# EAGLE design main (EAGLE 7.5.0)
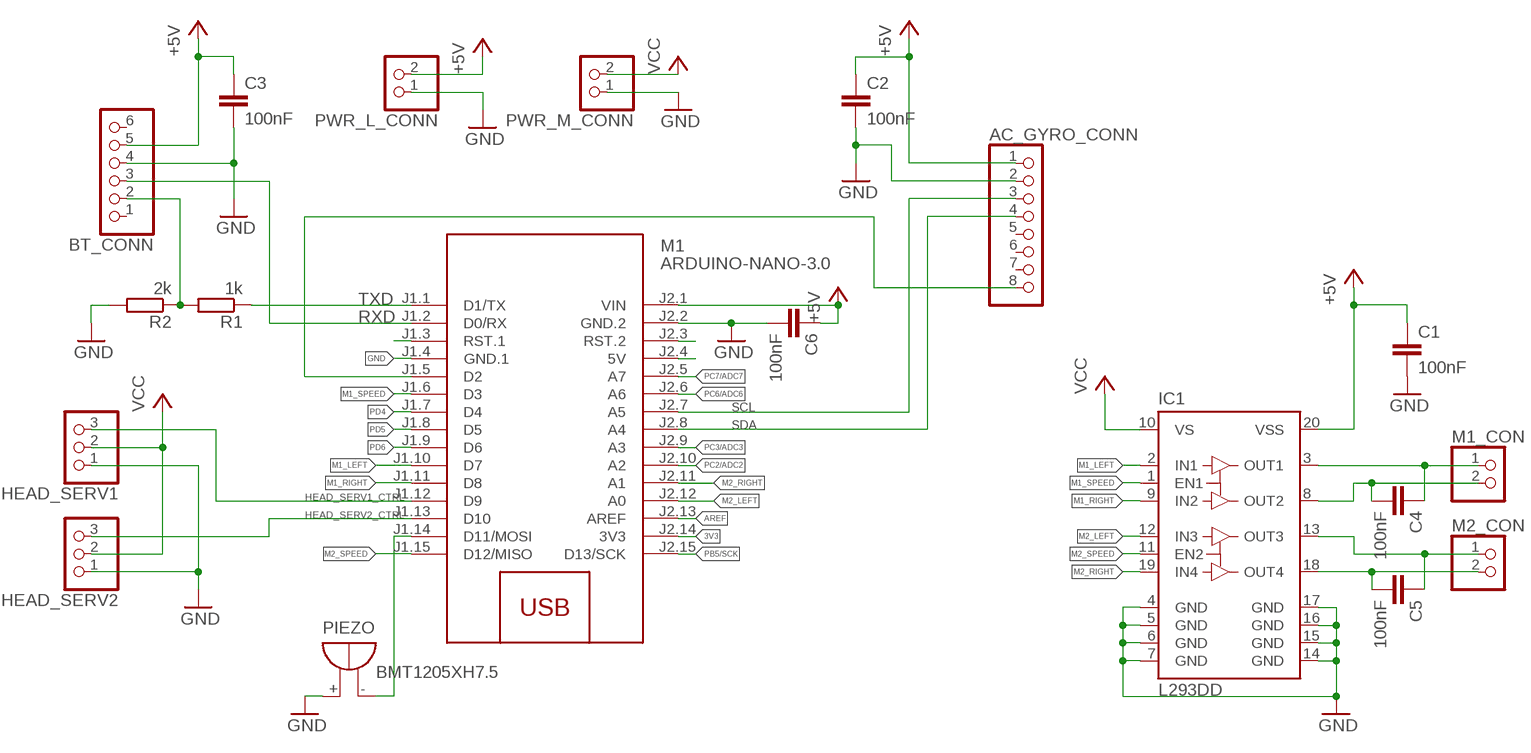
[diagram p0: schematic, sheet 1]

## Parts
AC_GYRO_CONN  PINHD-1X8  [1X08]
BT_CONN  PINHD-1X6  [1X06]
C1  100nF  C-EUC0805  [C0805]
C2  100nF  C-EUC0805  [C0805]
C3  100nF  C-EUC0805  [C0805]
C4  100nF  C-EUC0805  [C0805]
C5  100nF  C-EUC0805  [C0805]
C6  100nF  C-EUC0805  [C0805]
HEAD_SERV1  PINHD-1X3  [1X03]
HEAD_SERV2  PINHD-1X3  [1X03]
IC1  L293DD  [SO20]
M1  ARDUINO-NANO-3.0  [ARDUINO-NANO-3.0]
M1_CON  PINHD-1X2  [1X02]
M2_CON  PINHD-1X2  [1X02]
PIEZO  BMT1205XH7.5  [BMT1205XH7.5]
PWR_L_CONN  PINHD-1X2  [1X02]
PWR_M_CONN  PINHD-1X2  [1X02]
R1  1k  R-EU_0207/10  [0207/10]
R2  2k  R-EU_0207/10  [0207/10]

## Nets
3V3: M1.J2.14(3V3)
+5V: AC_GYRO_CONN.1 BT_CONN.5 C1.1 C2.1 C3.1 C6.1 IC1.20(VSS) M1.J2.1(VIN) PWR_L_CONN.2
AC_GYRO_INT: AC_GYRO_CONN.8 M1.J1.5(D2)
AREF: M1.J2.13(AREF)
GND: AC_GYRO_CONN.2 BT_CONN.4 C1.2 C2.2 C3.2 C6.2 HEAD_SERV1.1 HEAD_SERV2.1 IC1.4(GND) IC1.5(GND) IC1.6(GND) IC1.7(GND) IC1.14(GND) IC1.15(GND) IC1.16(GND) IC1.17(GND) M1.J1.4(GND.1) M1.J2.2(GND.2) PIEZO.+ PWR_L_CONN.1 PWR_M_CONN.1 R2.2
HEAD_SERV1_CTRL: HEAD_SERV1.3 M1.J1.12(D9)
HEAD_SERV2_CTRL: HEAD_SERV2.3 M1.J1.13(D10)
M1_LEFT: IC1.2(IN1) M1.J1.10(D7)
M1_RIGHT: IC1.9(IN2) M1.J1.11(D8)
M1_SPEED: IC1.1(EN1) M1.J1.6(D3)
M2_LEFT: IC1.12(IN3) M1.J2.12(A0)
M2_RIGHT: IC1.19(IN4) M1.J2.11(A1)
M2_SPEED: IC1.11(EN2) M1.J1.15(D12/MISO)
N$1: C4.1 IC1.3(OUT1) M1_CON.1
N$2: C4.2 IC1.8(OUT2) M1_CON.2
N$3: C5.2 IC1.18(OUT4) M2_CON.2
N$4: C5.1 IC1.13(OUT3) M2_CON.1
N$5: BT_CONN.2 R1.2 R2.1
N$6: M1.J1.3(RST.1)
N$11: M1.J2.3(RST.2)
N$13: M1.J2.4(5V)
PB4: M1.J1.14(D11/MOSI) PIEZO.-
PB5/SCK: M1.J2.15(D13/SCK)
PC2/ADC2: M1.J2.10(A2)
PC3/ADC3: M1.J2.9(A3)
PC6/ADC6: M1.J2.6(A6)
PC7/ADC7: M1.J2.5(A7)
PD4: M1.J1.7(D4)
PD5: M1.J1.8(D5)
PD6: M1.J1.9(D6)
RXD: BT_CONN.3 M1.J1.2(D0/RX)
SCL: AC_GYRO_CONN.3 M1.J2.7(A5)
SDA: AC_GYRO_CONN.4 M1.J2.8(A4)
TXD: M1.J1.1(D1/TX) R1.1
VCC: HEAD_SERV1.2 HEAD_SERV2.2 IC1.10(VS) PWR_M_CONN.2
Unconnected: AC_GYRO_CONN.5 AC_GYRO_CONN.6 AC_GYRO_CONN.7 BT_CONN.1 BT_CONN.6

## Library data of the parts
AC_GYRO_CONN = pinhead:PINHD-1X8: PIN HEADER
BT_CONN = pinhead:PINHD-1X6: PIN HEADER
C1-C6 = resistor:C-EU: CAPACITOR, European symbol
HEAD_SERV1 HEAD_SERV2 = pinhead:PINHD-1X3: PIN HEADER
IC1 = st-microelectronics:L293DD: PUSH-PULL FOUR CHANNEL DRIVER WITH DIODES Source: http://www.st.com/stonline/books/pdf/docs/1330.pdf; OC_FARNELL: unknown
M1 = diy-modules:ARDUINO-NANO-3.0: Arduino Nano 3.0
M1_CON M2_CON PWR_L_CONN PWR_M_CONN = pinhead:PINHD-1X2: PIN HEADER
PIEZO = buzzer:BMT1205XH7.5: MAGNETIC TRANSDUCER Source: Http:www.be-star.com; OC_FARNELL: unknown; OC_NEWARK: unknown
R1 R2 = resistor:R-EU_: RESISTOR, European symbol

## Net classes
0 default: clearance 0.205 mm

## Board
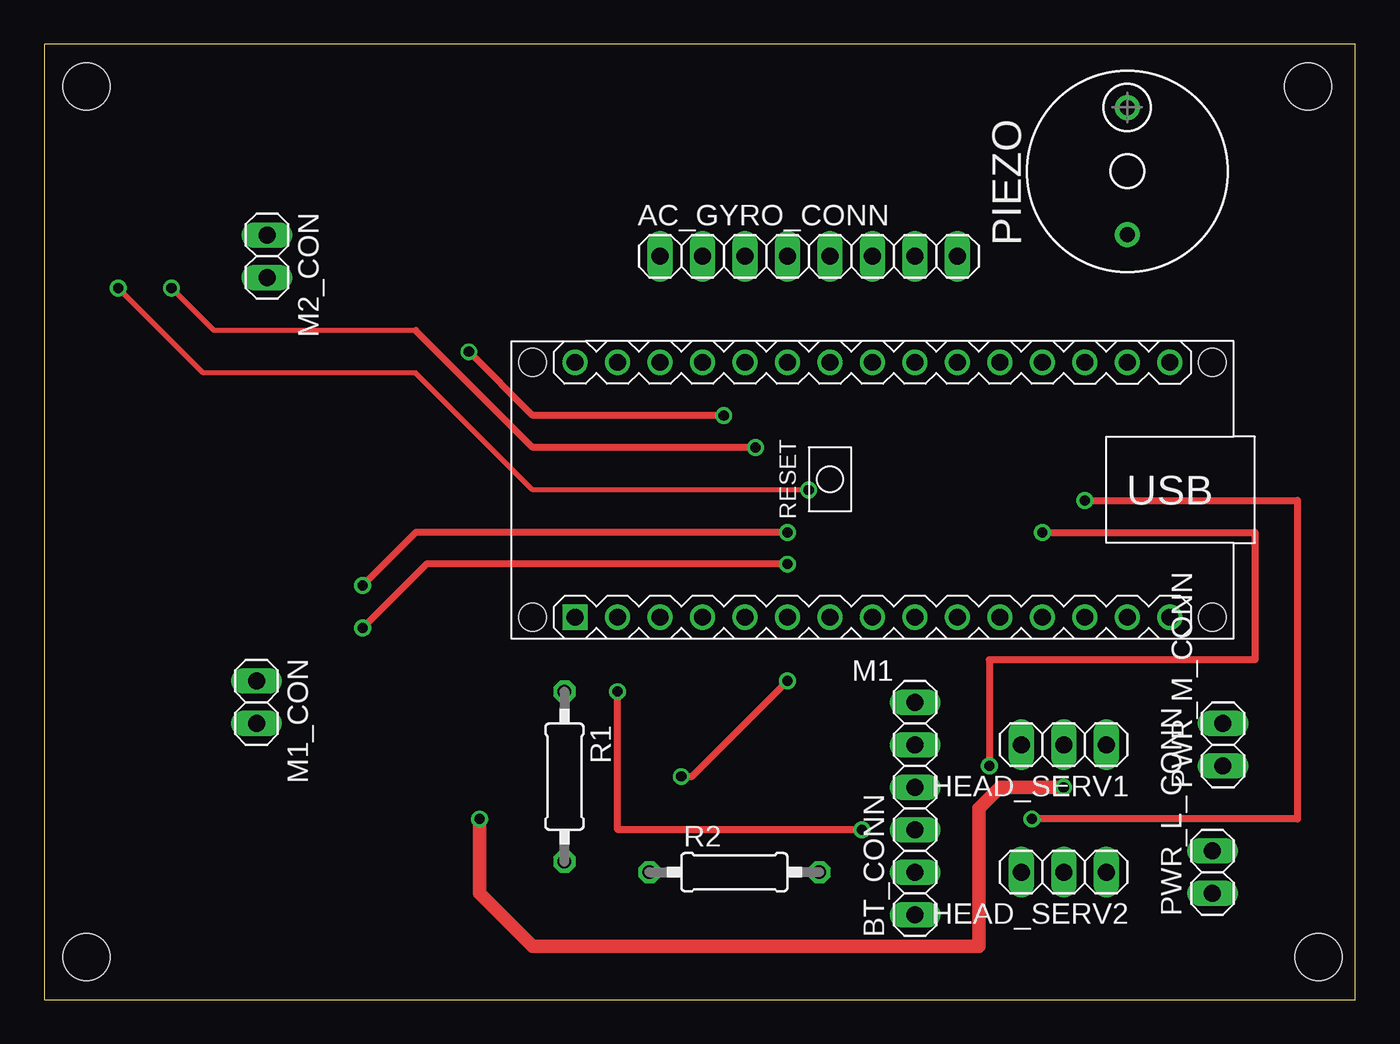
[diagram p1: board, top side]
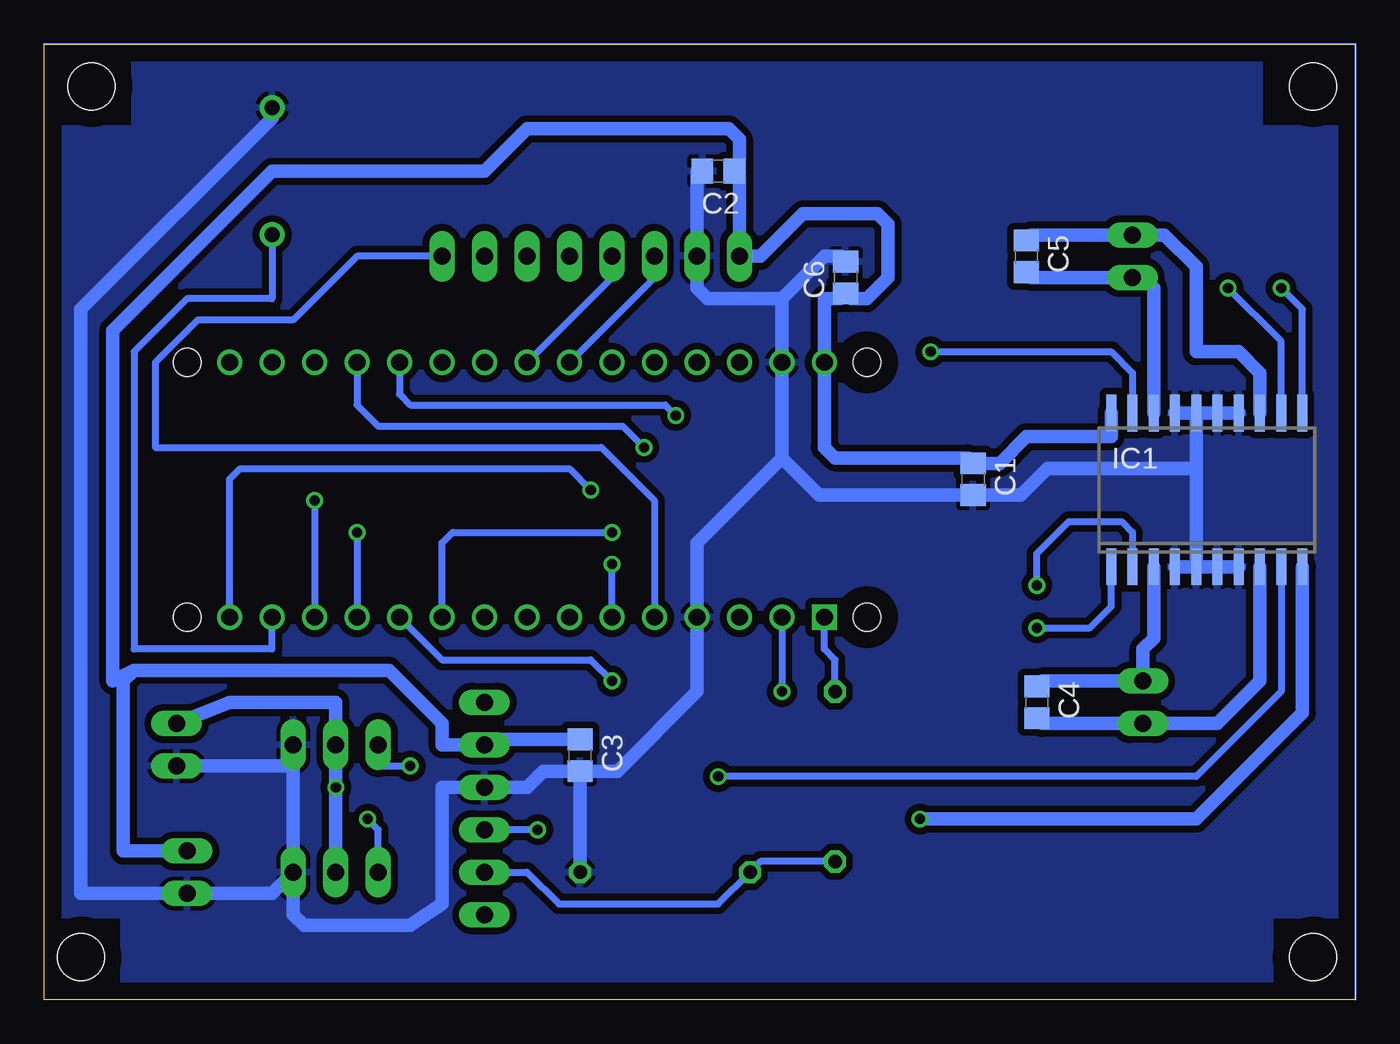
[diagram p2: board, bottom side, seen from below]

Size 78.41 x 57.14 mm. Coordinates in mm from the lower left corner, seen from the top.
Outline: 0,0 78.41,0 78.41,57.14 0,57.14 0,0
Copper layers (1*16): Top 0.035mm / dielectric 1.5mm / Bottom 0.035mm
Design rules "default *": minimum track width 10mil, minimum drill 24mil, track to track 16mil, track to pad 16mil, pad to pad 16mil, via to via 16mil, smd to smd 8mil, copper to edge 40mil, drill to drill 8mil, minimum pad ring 10mil, minimum via ring 8mil, stop-mask expansion 4mil, vias tented up to drill 0mil, thermal gap 10mil
Holes 2.8 mm at 2.54,54.61 75.56,54.61 76.2,2.54 2.54,2.54

### Footprints (pad centres in the part's own frame; a part is rotated, then mirrored left to right if it is on the bottom)
1X08 = drill 1.016 long: 1 -8.89,0; 2 -6.35,0; 3 -3.81,0; 4 -1.27,0; 5 1.27,0; 6 3.81,0; 7 6.35,0; 8 8.89,0
1X06 = drill 1.016 long: 1 -6.35,0; 2 -3.81,0; 3 -1.27,0; 4 1.27,0; 5 3.81,0; 6 6.35,0
C0805 = smd 1.3 x 1.5: 1 -0.95,0; 2 0.95,0
1X03 = drill 1.016 long: 1 -2.54,0; 2 0,0; 3 2.54,0
SO20 = smd 0.6 x 2.2: 1 -5.715,-4.6; 2 -4.445,-4.6; 3 -3.175,-4.6; 4 -1.905,-4.6; 5 -0.635,-4.6; 6 0.635,-4.6; 7 1.905,-4.6; 8 3.175,-4.6; 9 4.445,-4.6; 10 5.715,-4.6; 11 5.715,4.6; 12 4.445,4.6; 13 3.175,4.6; 14 1.905,4.6; 15 0.635,4.6; 16 -0.635,4.6; 17 -1.905,4.6; 18 -3.175,4.6; 19 -4.445,4.6; 20 -5.715,4.6
ARDUINO-NANO-3.0 = drill 1 square: J1.1 17.78,7.62 | drill 1: J1.2 15.24,7.62; J1.3 12.7,7.62; J1.4 10.16,7.62; J1.5 7.62,7.62; J1.6 5.08,7.62; J1.7 2.54,7.62; J1.8 0,7.62; J1.9 -2.54,7.62; J1.10 -5.08,7.62; J1.11 -7.62,7.62; J1.12 -10.16,7.62; J1.13 -12.7,7.62; J1.14 -15.24,7.62; J1.15 -17.78,7.62; J2.1 17.78,-7.62; J2.2 15.24,-7.62; J2.3 12.7,-7.62; J2.4 10.16,-7.62; J2.5 7.62,-7.62; J2.6 5.08,-7.62; J2.7 2.54,-7.62; J2.8 0,-7.62; J2.9 -2.54,-7.62; J2.10 -5.08,-7.62; J2.11 -7.62,-7.62; J2.12 -10.16,-7.62; J2.13 -12.7,-7.62; J2.14 -15.24,-7.62; J2.15 -17.78,-7.62 | hole 1.651: -20.32,7.62; -20.32,-7.62; 20.32,-7.62; 20.32,7.62
1X02 = drill 1.016 long: 1 -1.27,0; 2 1.27,0
BMT1205XH7.5 = drill 0.9 pad 1.5: + 3.8,0; - -3.8,0
0207/10 = drill 0.813 octagon: 1 -5.08,0; 2 5.08,0

### Placement (x,y rotation side)
AC_GYRO_CONN  45.72,44.45 0 top
BT_CONN  52.07,11.43 90 top
C1  22.86,31.11 270 bottom
C2  38.1,49.53 180 bottom
C3  46.36,14.61 270 bottom
C4  19.05,17.78 270 bottom
C5  19.68,44.45 270 bottom
C6  30.48,43.18 90 bottom
HEAD_SERV1  60.96,15.24 180 top
HEAD_SERV2  60.96,7.62 180 top
IC1  8.89,30.48 0 bottom
M1  49.53,30.48 180 top
M1_CON  12.7,17.78 270 top
M2_CON  13.33,44.45 270 top
PIEZO  64.77,49.53 90 top
PWR_L_CONN  69.85,7.62 90 top
PWR_M_CONN  70.48,15.24 90 top
R1  31.11,13.34 270 top
R2  41.28,7.62 0 top

### Tracks (layer width: path | path; a pad name or v marks a point on that pad's centre or on a via)
+5V
  Bottom 0.406: C2.1 36.83,49.53
  Bottom 0.813: 36.83,49.53 AC_GYRO_CONN.1 35.56,44.45 33.02,46.99 28.57,46.99 27.94,46.36 27.94,43.18 29.21,41.91 30.16,41.91 C6.1 30.8,41.91 31.75,41.91 M1.J2.1 31.75,33.02 31.11,32.38 23.18,32.38 C1.1 21.28,32.06 19.68,33.66 14.61,33.66 IC1.20 | C3.1 51.75,15.55 BT_CONN.5 54.61,15.24 54.61,16.51 57.78,19.68 73.03,19.68 | PWR_L_CONN.2 73.66,8.89 73.66,19.05 73.03,19.68 | 73.03,19.68 74.3,19.05 74.3,40.01 64.77,49.53 52.07,49.53 49.53,52.07 37.47,52.07 36.83,51.44 36.83,49.85 C2.1
AC_GYRO_INT
  Bottom 0.406: AC_GYRO_CONN.8 59.69,44.45 63.5,40.64 69.22,40.64 71.75,38.1 71.75,33.02 45.09,33.02 41.91,29.84 M1.J1.5
GND
  Bottom 0.406: C2.2 39.37,49.53
  Bottom 0.813: 39.37,49.53 AC_GYRO_CONN.2 39.37,42.55 38.73,41.91 34.29,41.91 | 34.29,41.91 M1.J2.2 34.29,32.38 | 34.29,41.91 31.75,44.45 30.8,44.45 C6.2 | C3.2 48.58,13.66 49.53,12.7 BT_CONN.4 54.61,12.7 54.61,5.71 56.52,4.45 62.87,4.45 63.5,5.08 HEAD_SERV2.1 | HEAD_SERV2.1 64.77,6.35 PWR_L_CONN.1 76.2,6.35 76.2,41.28 64.77,52.71 PIEZO.+ | HEAD_SERV2.1 63.5,13.97 | 63.5,13.97 HEAD_SERV1.1 | PWR_M_CONN.1 63.5,13.97 | R2.2 C3.2 | C3.2 44.13,13.66 39.37,18.41 M1.J1.4 39.37,27.3 34.29,32.38 | IC1.16 IC1.15 IC1.14 | IC1.16 IC1.17 | IC1.7 IC1.6 IC1.5 | IC1.5 IC1.4 | IC1.16 9.53,31.75 | 9.53,31.75 IC1.5 | 9.53,31.75 18.41,31.75 20,30.16 C1.2 32.07,30.16 34.29,32.38
  pour Bottom: 0.63,52.07 5.71,52.07 5.71,56.52 73.03,56.52 73.03,53.98 73.03,52.07 77.47,52.07 77.47,5.08 73.66,5.08 73.66,0.64 5.08,0.64 5.08,5.08 0.63,5.08
HEAD_SERV1_CTRL  (via drill 0.6)
  Top 0.406: v59.69,27.94 72.39,27.94 72.39,20.32 56.52,20.32 v56.52,13.97
  Bottom 0.406: HEAD_SERV1.3 58.42,13.97 v56.52,13.97 | v59.69,27.94 M1.J1.12
HEAD_SERV2_CTRL  (via drill 0.6)
  Top 0.406: v62.23,29.84 74.93,29.84 74.93,10.79 v59.06,10.79
  Bottom 0.406: HEAD_SERV2.3 58.42,10.16 v59.06,10.79 | v62.23,29.84 M1.J1.13
M1_LEFT  (via drill 0.6)
  Top 0.406: v44.45,27.94 22.22,27.94 v19.05,24.76
  Bottom 0.406: M1.J1.10 54.61,27.3 53.98,27.94 v44.45,27.94 | v19.05,24.76 19.05,26.67 17.14,28.57 13.97,28.57 13.33,27.94 IC1.2
M1_RIGHT  (via drill 0.6)
  Top 0.406: v38.1,13.34 38.73,13.34 v44.45,19.05
  Bottom 0.406: IC1.9 4.44,18.41 9.53,13.34 v38.1,13.34 | M1.J1.11 54.61,20.32 45.72,20.32 v44.45,19.05
M1_SPEED  (via drill 0.6)
  Top 0.406: v44.45,26.04 22.86,26.04 v19.05,22.22
  Bottom 0.406: M1.J1.6 v44.45,26.04 | v19.05,22.22 15.87,22.22 14.61,23.49 IC1.1
M2_LEFT  (via drill 0.6)
  Top 0.305: 22.22,40.01 10.16,40.01 v7.62,42.55
  Top 0.406: v42.55,33.02 29.21,33.02 22.22,40.01
  Bottom 0.406: M1.J2.12 59.69,35.56 58.42,34.29 43.81,34.29 v42.55,33.02 | IC1.12 4.44,39.37 v7.62,42.55
M2_RIGHT  (via drill 0.6)
  Top 0.406: v40.64,34.92 29.21,34.92 v25.4,38.73
  Bottom 0.406: M1.J2.11 57.15,36.2 56.52,35.56 41.28,35.56 v40.64,34.92 | v25.4,38.73 14.61,38.73 13.33,37.47 IC1.19
M2_SPEED  (via drill 0.6)
  Top 0.305: v45.72,30.48 29.21,30.48 22.22,37.47 9.53,37.47 v4.44,42.55
  Bottom 0.406: M1.J1.15 67.31,31.11 66.67,31.75 46.99,31.75 v45.72,30.48 | IC1.11 3.17,41.28 v4.44,42.55
N$1
  Bottom 0.813: IC1.3 12.07,21.59 12.7,20.95 M1_CON.1 18.73,19.05 C4.1
N$2
  Bottom 0.813: IC1.8 5.71,19.05 8.25,16.51 M1_CON.2 18.73,16.51 C4.2
N$3
  Bottom 0.813: IC1.18 12.07,42.55 12.7,43.18 M2_CON.2 19.36,43.18 C5.2
N$4
  Bottom 0.813: C5.1 19.36,45.72 13.97,45.72 M2_CON.1 11.43,45.72 9.53,43.82 9.53,38.73 6.98,38.73 5.71,37.47 IC1.13
N$5
  Bottom 0.406: R1.2 35.56,8.26 R2.1 38.1,5.71 47.62,5.71 49.53,7.62 BT_CONN.2
PB4
  Bottom 0.406: PIEZO.- 64.77,41.91 69.85,41.91 73.03,38.73 73.03,20.95 64.77,20.95 M1.J1.14
RXD  (via drill 0.6)
  Top 0.406: v48.89,10.16 34.29,10.16 v34.29,18.41
  Bottom 0.406: v48.89,10.16 BT_CONN.3 | M1.J1.2 v34.29,18.41
SCL
  Bottom 0.406: AC_GYRO_CONN.3 41.91,43.18 M1.J2.7
SDA
  Bottom 0.406: AC_GYRO_CONN.4 44.45,43.18 M1.J2.8
TXD
  Bottom 0.406: R1.1 31.11,20.32 31.75,20.95 M1.J1.1
VCC  (via drill 0.6)
  Top 0.813: v60.96,12.7 57.15,12.7 55.88,11.43 55.88,3.17 29.21,3.17 26.04,6.35 v26.04,10.79
  Bottom 0.813: HEAD_SERV2.2 v60.96,12.7 HEAD_SERV1.2 60.96,17.78 67.31,17.78 PWR_M_CONN.2 | v26.04,10.79 9.53,10.79 3.17,17.14 IC1.10
(copper drawn outside any net)
  shapes: Bottom area x2